# EAGLE schematic My board_6 (EAGLE 7.6.0)
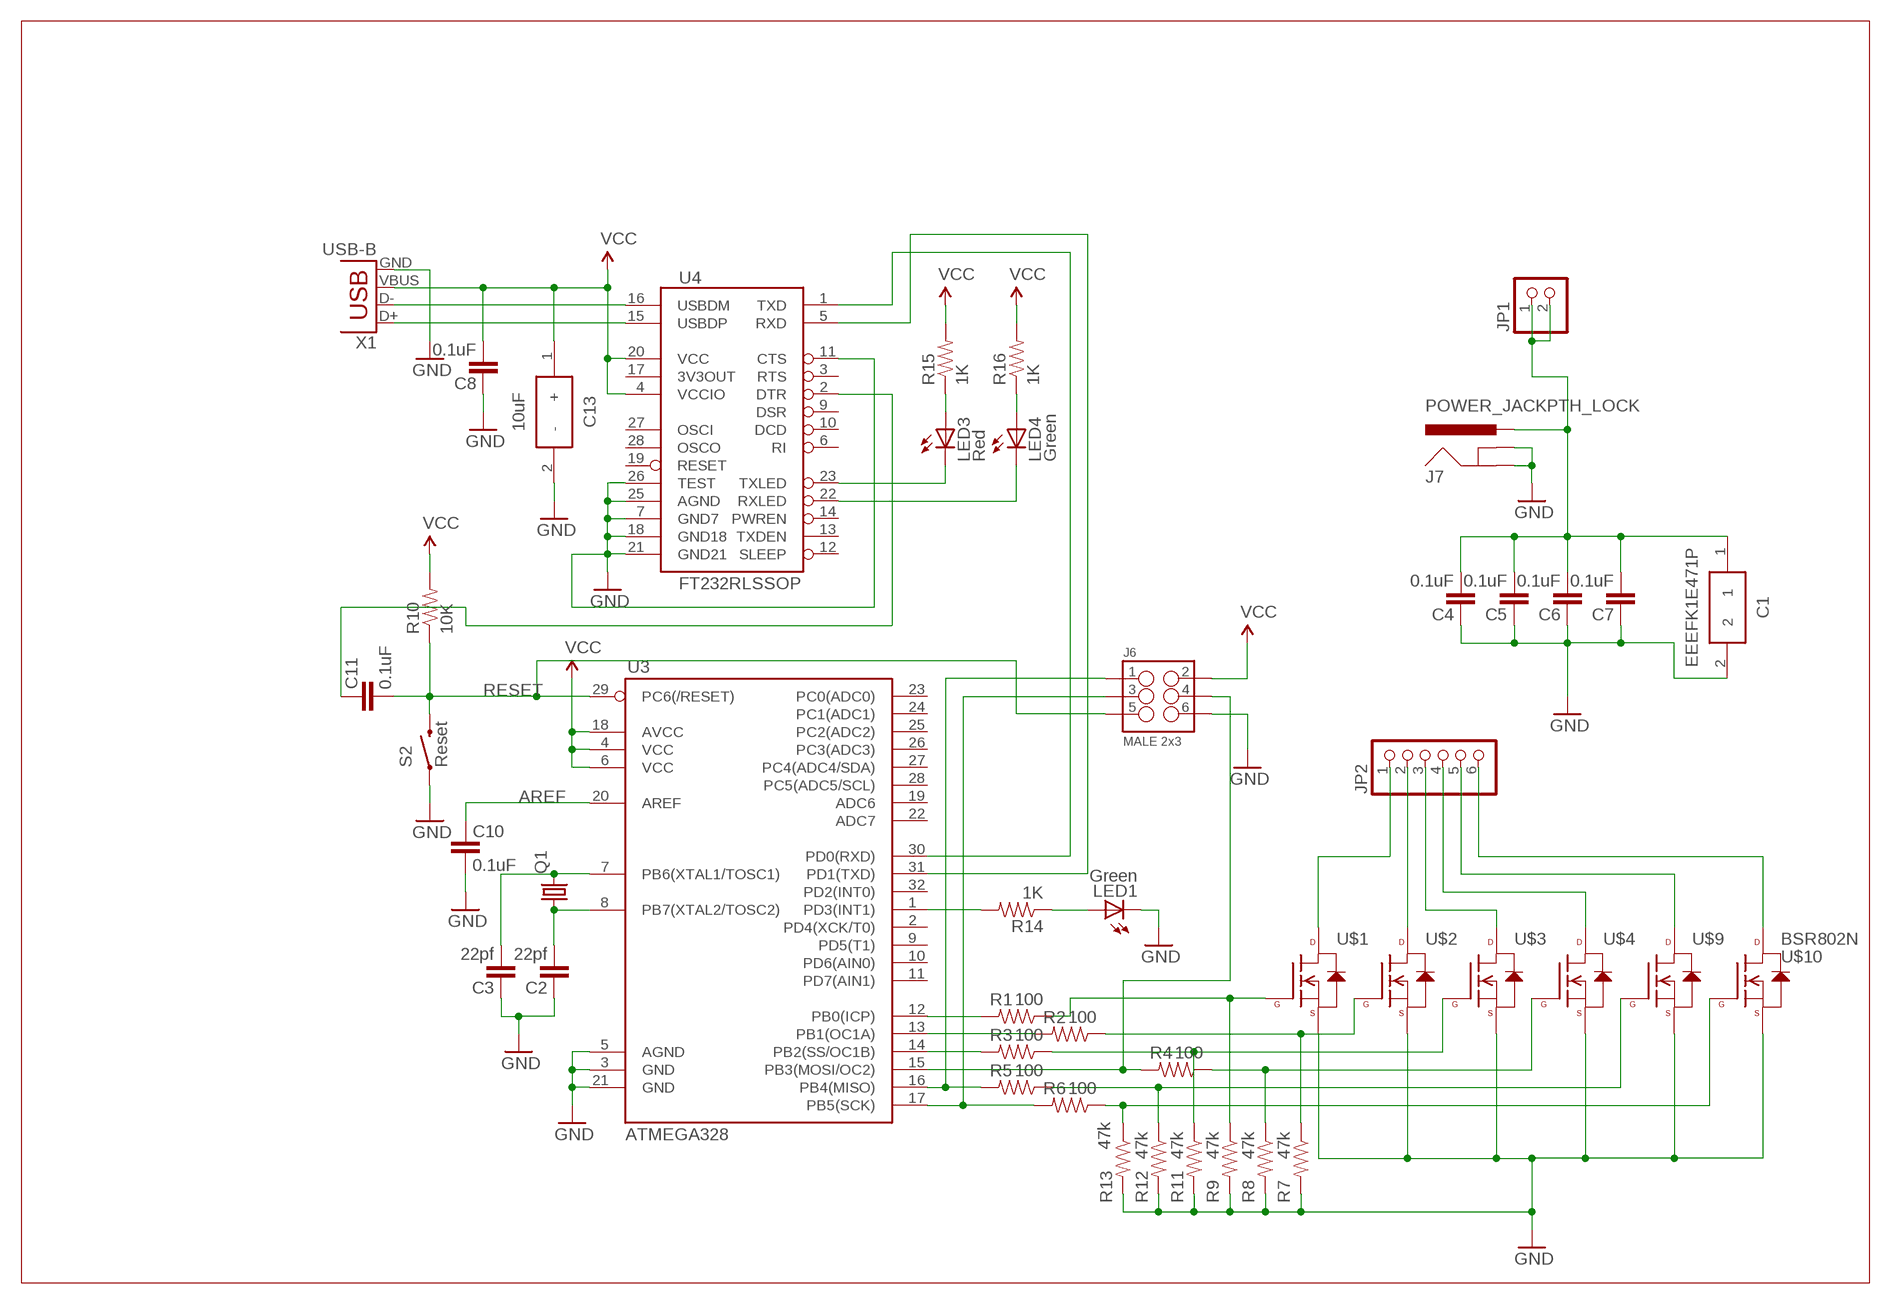
[diagram p0: schematic, sheet 1]

## Parts
C1  EEEFK1E471P  [ALUMINUM-ELECTROLYTIC-CAPACITO]
C2  22pf  CAP0603-CAP  [0603-CAP]
C3  22pf  CAP0603-CAP  [0603-CAP]
C4  0.1uF  CAP0603-CAP  [0603-CAP]
C5  0.1uF  CAP0603-CAP  [0603-CAP]
C6  0.1uF  CAP0603-CAP  [0603-CAP]
C7  0.1uF  CAP0603-CAP  [0603-CAP]
C8  0.1uF  CAP0603-CAP  [0603-CAP]
C10  0.1uF  CAP0603-CAP  [0603-CAP]
C11  0.1uF  CAP0603-CAP  [0603-CAP]
C13  10uF  ECEA1HKS100  [ECEA1HKS100B]
J6  MALE 2x3  M03X2FEMALE  [2X3]
J7  POWER_JACKPTH_LOCK  [POWER_JACK_PTH_LOCK]
JP1  PINHD-1X2  [1X02]
JP2  PINHD-1X6  [1X06]
LED1  Green  LED0603  [LED-0603]
LED3  Red  LED0603  [LED-0603]
LED4  Green  LED0603  [LED-0603]
Q1  CRYSTALHC49S  [HC49/S]
R1  100  RESISTOR0603-RES  [0603-RES]
R2  100  RESISTOR0603-RES  [0603-RES]
R3  100  RESISTOR0603-RES  [0603-RES]
R4  100  RESISTOR0603-RES  [0603-RES]
R5  100  RESISTOR0603-RES  [0603-RES]
R6  100  RESISTOR0603-RES  [0603-RES]
R7  47k  RESISTOR0603-RES  [0603-RES]
R8  47k  RESISTOR0603-RES  [0603-RES]
R9  47k  RESISTOR0603-RES  [0603-RES]
R10  10K  RESISTOR0603-RES  [0603-RES]
R11  47k  RESISTOR0603-RES  [0603-RES]
R12  47k  RESISTOR0603-RES  [0603-RES]
R13  47k  RESISTOR0603-RES  [0603-RES]
R14  1K  RESISTOR0603-RES  [0603-RES]
R15  1K  RESISTOR0603-RES  [0603-RES]
R16  1K  RESISTOR0603-RES  [0603-RES]
S2  Reset  SWITCH-MOMENTARY-2SMD-ALT01  [TACTILE-SWITCH-SMD-ALT01]
U3  ATMEGA328  ATMEGA168  [TQFP32-08]
U4  FT232RLSSOP  [SSOP28DB]
U$1  N-CHANNEL-MOSFET-BSS138  [SOT23-3]
U$2  N-CHANNEL-MOSFET-BSS138  [SOT23-3]
U$3  N-CHANNEL-MOSFET-BSS138  [SOT23-3]
U$4  N-CHANNEL-MOSFET-BSS138  [SOT23-3]
U$9  N-CHANNEL-MOSFET-BSS138  [SOT23-3]
U$10  BSR802N  N-CHANNEL-MOSFET-BSS138  [SOT23-3]
X1  USB-B  USBPTH  [USB-B-PTH]

## Nets
5V: C8.1 C13.1(+) J6.2 R10.2 R15.2 R16.2 U3.4(VCC) U3.6(VCC) U3.18(AVCC) U4.4(VCCIO) U4.20(VCC) X1.VBUS ; supply symbol labelled VCC
AREF: C10.2 U3.20(AREF)
ASD: C1.2 C2.2 C3.2 C4.2 C5.2 C6.2 C7.2 C8.2 C10.1 C13.2(-) J6.6 R7.2 R8.2 R9.2 R11.2 R12.2 R13.2 S2.1 S2.2 U3.3(GND) U3.5(AGND) U3.21(GND) U4.7(GND7) U4.11(CTS) U4.18(GND18) U4.21(GND21) U4.25(AGND) U4.26(TEST) U$1.2(S) U$2.2(S) U$3.2(S) U$4.2(S) U$9.2(S) U$10.2(S) X1.GND ; supply symbol labelled GND
DTR1: C11.2 U4.2(DTR)
GND: J7.GND J7.GNDBREAK LED1.C
N$1: JP2.5 U$9.3(D)
N$2: JP2.6 U$10.3(D)
N$3: R3.2 U3.14(PB2(SS/OC1B))
N$4: R2.1 R7.1 U$2.1(G)
N$5: R3.1 R11.1 U$3.1(G)
N$6: R1.1 R9.1 U$1.1(G)
N$7: R4.1 R8.1 U$4.1(G)
N$8: R5.1 R12.1 U$9.1(G)
N$9: R6.1 R13.1 U$10.1(G)
N$11: LED1.A R14.1
N$12: R14.2 U3.1(PD3(INT1))
N$13: C2.1 Q1.1 U3.8(PB7(XTAL2/TOSC2))
N$26: C3.1 Q1.2 U3.7(PB6(XTAL1/TOSC1))
N$27: LED3.A R15.1
N$28: LED4.A R16.1
N$29: U3.31(PD1(TXD)) U4.5(RXD)
N$30: U3.30(PD0(RXD)) U4.1(TXD)
N$31: R1.2 U3.12(PB0(ICP))
N$32: R2.2 U3.13(PB1(OC1A))
N$34: J6.4 R4.2 U3.15(PB3(MOSI/OC2))
N$39: JP2.1 U$1.3(D)
N$40: JP2.2 U$2.3(D)
N$41: JP2.3 U$3.3(D)
N$42: JP2.4 U$4.3(D)
N$43: J6.1 R5.2 U3.16(PB4(MISO))
N$44: C1.1 C4.1 C5.1 C6.1 C7.1 J7.PWR JP1.1 JP1.2
RESET: C11.1 J6.5 R10.1 S2.3 S2.4 U3.29(PC6(/RESET))
RXLED1: LED4.C U4.22(RXLED)
SCK1: J6.3 R6.2 U3.17(PB5(SCK))
TXLED1: LED3.C U4.23(TXLED)
USB_D+1: U4.15(USBDP) X1.D+
USB_D-1: U4.16(USBDM) X1.D-
Unconnected: U3.2(PD4(XCK/T0)) U3.9(PD5(T1)) U3.10(PD6(AIN0)) U3.11(PD7(AIN1)) U3.19(ADC6) U3.22(ADC7) U3.23(PC0(ADC0)) U3.24(PC1(ADC1)) U3.25(PC2(ADC2)) U3.26(PC3(ADC3)) U3.27(PC4(ADC4/SDA)) U3.28(PC5(ADC5/SCL)) U3.32(PD2(INT0)) U4.3(RTS) U4.6(RI) U4.9(DSR) U4.10(DCD) U4.12(SLEEP) U4.13(TXDEN) U4.14(PWREN) U4.17(3V3OUT) U4.19(RESET) U4.27(OSCI) U4.28(OSCO)

## Library data of the parts
C1 = SamacSys_Parts:EEEFK1E471P: Aluminum Electrolytic Capacitors - SMD 470UF 25V FK SMD <https://componentsearchengine.com/Images/1/EEE-FK1E471P.jpg> Source: Datasheet <http://industrial.panasonic.com/cdbs/www-data/pdf/RDE0000/ABA0000C774.pdf>; DESCRIPTION: Aluminum Electrolytic Capacitors - SMD 470UF 25V FK SMD; HEIGHT: mm; MANUFACTURER_NAME: Panasonic; MANUFACTURER_PART_NUMBER: EEEFK1E471P; RS_PART_NUMBER: 5370528; SUPPLIER_NAME: RS
C2-C8 C10 C11 = SparkFun:CAP: Capacitor Standard 0603 ceramic capacitor, and 0.1" leaded capacitor.
C13 = SamacSys_Parts:ECEA1HKS100: KS radial Al electrolytic cap,10uF 50V Panasonic 10F 50 V dc, Through Hole Aluminium Electrolytic Capacitor, 20% <https://componentsearchengine.com/Images/3/ECEA1HKS100.jpg> Source: Datasheet <http://uk.rs-online.com/web/p/products/0117035>; DESCRIPTION: KS radial Al electrolytic cap,10uF 50V Panasonic 10F 50 V dc, Through Hole Aluminium Electrolytic Capacitor, 20%; HEIGHT: mm; MANUFACTURER_NAME: Panasonic; MANUFACTURER_PART_NUMBER: ECEA1HKS100; RS_PART_NUMBER: 9190461; SUPPLIER_NAME: RS
J6 = Connectors:M03X2: 2x3 .1" header. Shrouded, with keying- CONN-10681 SMT- CONN-11415 Pogo pins- HW-11044; PROD_ID: CONN-11566; VALUE: FEMALE 2x3
J7 = Connectors:POWER_JACK: Power Jack This is the standard 5.5mm barrel jack for power. The PTH is the most common, proven, reliable, footprint. The Slot footprint only works if the mill layer is transmitted to the PCB fab house so be warned. Mating wall wart : TOL-00298 (and others); PROD_ID: CONN-08197; SF_ID: PRT-00119
JP1 = pinhead:PINHD-1X2: PIN HEADER
JP2 = pinhead:PINHD-1X6: PIN HEADER
LED1 LED3 LED4 = SparkFun:LED: LEDs Standard schematic elements and footprints for 5mm, 3mm, 1206, and 0603 sized LEDs. 5mm - Spark Fun Electronics SKU : COM-00529 (and others)
Q1 = crystal:CRYSTAL: CRYSTAL; OC_FARNELL: 1667008; OC_NEWARK: unknown
R1-R13 = SparkFun:RESISTOR: Resistor Basic schematic elements and footprints for 0603, 1206, and PTH resistors.
R14-R16 = Passives:RESISTOR: Resistor Basic schematic elements and footprints for 0603, 1206, and PTH resistors.
S2 = Testing:SWITCH-MOMENTARY-2: Various NO switches- pushbuttons, reed, etc
U3 = SparkFun:ATMEGA168
U4 = SparkFun:FT232RL: USB UART FT232RL 4th Generation USB UART (USB <-> Serial) Controller. Spark Fun Electronics SKU : COM-00650
U$1-U$4 U$9 U$10 = GeekAmmo:N-CHANNEL-MOSFET: N-Channel MOSFET Mode Field Effect Transistor; DATASHEET: http://www.fairchildsemi.com/ds/BS/BSS138.pdf; DIGIKEY: BSS138TR-ND; ELEMENT14: 2323154; URL: http://au.element14.com/fairchild-semiconductor/bss138/mosfet-n-ch-50v-220ma-sot-23/dp/2323154
X1 = Connectors:USB: USB Connectors USB-B-PTH is fully proven SKU : PRT-00139/CONN-08278 USB-miniB is fully proven SKU : PRT-00587 USB-A-PCB is untested. USB-A-H is throughly reviewed, but untested. Spark Fun Electronics SKU : PRT-00437 USB-B-SMT is throughly reviewed, but untested. Needs silkscreen touching up. USB-A-S has not been used/tested USB-MB-H has not been used/tested USB-MICROB has been used. CONN-09505; PROD_ID: CONN-08278

## Net classes
1 power: width 0.254 mm